# EAGLE schematic LowellMakesBadge (EAGLE 7.2.0)
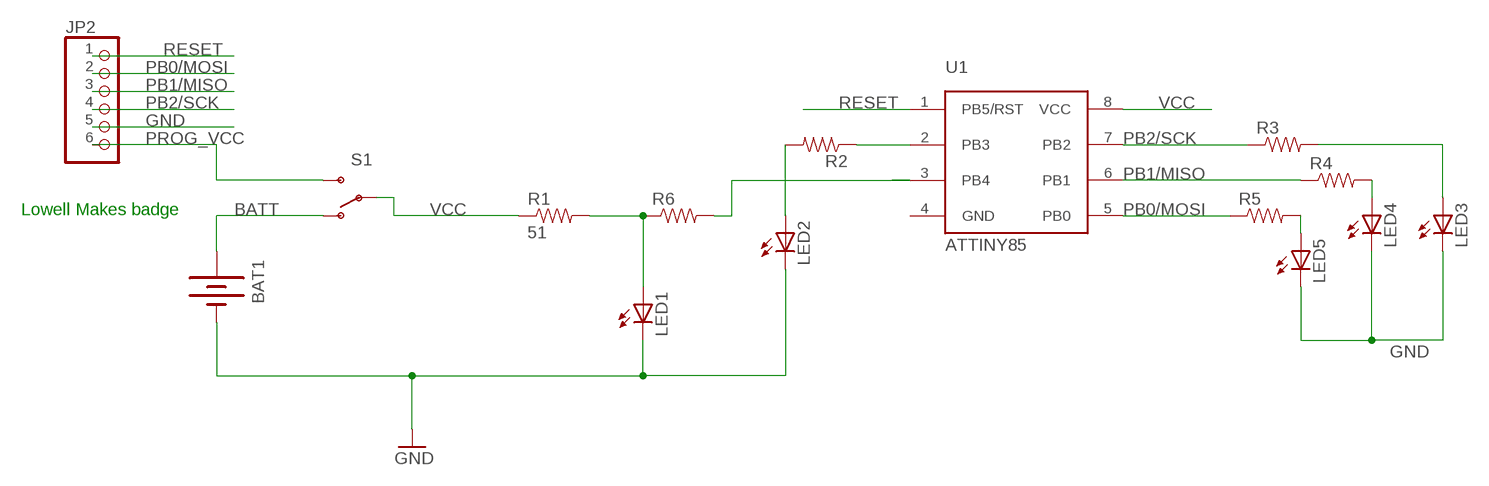
[diagram p0: schematic, sheet 1]

## Parts
BAT1  BATTERY12PTH  [BATTCON_12MM_PTH]
JP2  PINHD-1X6  [1X06]
LED1  LED5MM  [LED5MM]
LED2  LEDCHIP-LED0805  [CHIP-LED0805]
LED3  LEDCHIP-LED0805  [CHIP-LED0805]
LED4  LEDCHIP-LED0805  [CHIP-LED0805]
LED5  LEDCHIP-LED0805  [CHIP-LED0805]
R1  51  RESISTORPTH1  [AXIAL-0.3]
R2  RESISTOR  [0805]
R3  RESISTOR  [0805]
R4  RESISTOR  [0805]
R5  RESISTOR  [0805]
R6  RESISTOR  [0805]
S1  SWITCH-SPDTPTH  [SWITCH-SPDT]
U1  ATTINY85  [SOIC8]

## Nets
BATT: BAT1.VCC@1(+) S1.1(O)
GND: BAT1.GND(-) JP2.5 LED1.K(C) LED2.C LED3.C LED4.C LED5.C
N$1: LED1.A R1.P$2 R6.1
N$3: R6.2 U1.3(PB4)
N$4: LED5.A R5.2
N$5: R2.1 U1.2(PB3)
N$6: LED2.A R2.2
N$10: LED4.A R4.2
N$11: LED3.A R3.2
PB0/MOSI: JP2.2 R5.1 U1.5(PB0)
PB1/MISO: JP2.3 R4.1 U1.6(PB1)
PB2/SCK: JP2.4 R3.1 U1.7(PB2)
PROG_VCC: JP2.6 S1.3(S)
RESET: JP2.1 U1.1(PB5/RST)
VCC: R1.P$1 S1.2(P) U1.8(VCC)

## Notes on the sheet
- Lowell Makes badge

## Power pins joined to a net without a drawn wire
GND: U1.4(GND)

## Library data of the parts
BAT1 = SparkFun:BATTERY: Battery Holders Various common sizes : AA, AAA, 20mm coin cell and 12mm coin cell.
JP2 = pinhead:PINHD-1X6: PIN HEADER
LED1 = led:LED: LED
LED2-LED5 = adafruit:LED: LED
R1-R6 = SparkFun:RESISTOR: Resistor Basic schematic elements and footprints for 0603, 1206, and PTH 1/10th watt (small) resistors.
S1 = LowellMakesEagleLibrary:SWITCH-SPDT: SPDT Switch Simple slide switch, Spark Fun Electronics SKU : COM-00102 DPDT SMT slide switch, AYZ0202, SWCH-08179; PROD_ID: SWCH-08261
U1 = LowellMakesEagleLibrary:ATTINY85